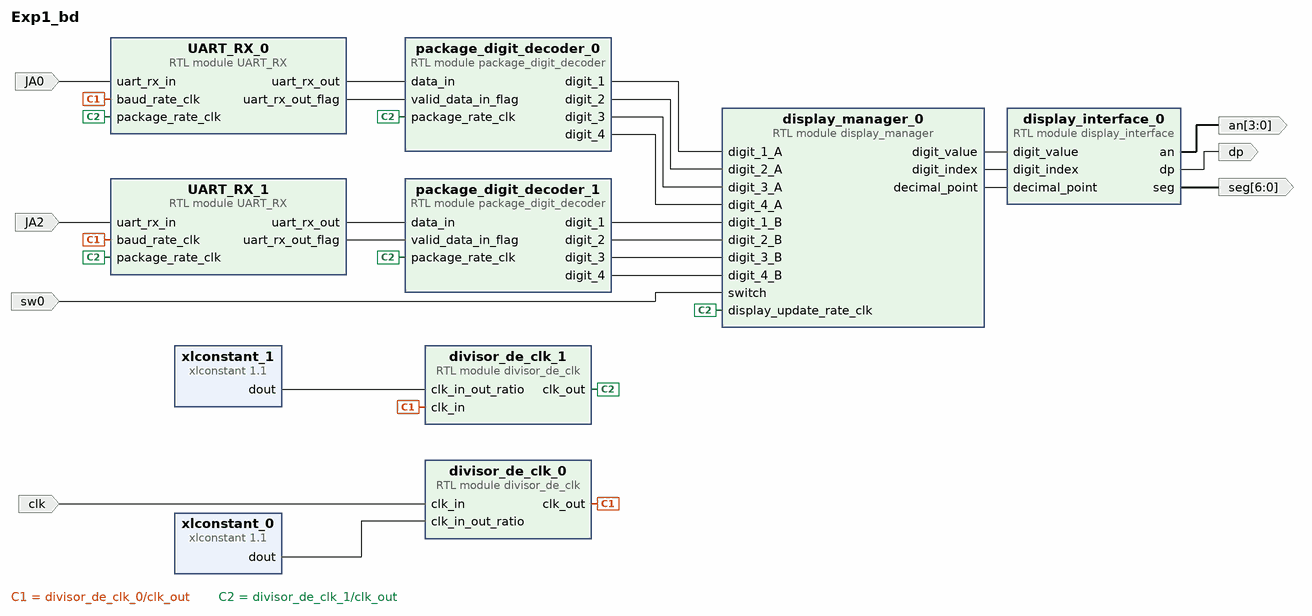
[diagram p0: block diagram of the top level]
# Vivado block design Exp1_bd, xc7a35tcpg236-1, Vivado 2020.1
create_bd_design Exp1_bd

create_bd_port -dir I clk
create_bd_port -dir I sw0
create_bd_port -dir O -from 6 -to 0 seg
create_bd_port -dir O dp
create_bd_port -dir O -from 3 -to 0 an
create_bd_port -dir I JA2
create_bd_port -dir I JA0

create_bd_cell -type module -reference divisor_de_clk divisor_de_clk_0
create_bd_cell -type ip -vlnv xilinx.com:ip:xlconstant:1.1 xlconstant_0
set_property -dict {CONFIG.CONST_VAL 10000 CONFIG.CONST_WIDTH 14} [get_bd_cells xlconstant_0]
create_bd_cell -type module -reference divisor_de_clk divisor_de_clk_1
create_bd_cell -type ip -vlnv xilinx.com:ip:xlconstant:1.1 xlconstant_1
set_property -dict {CONFIG.CONST_VAL 11 CONFIG.CONST_WIDTH 14} [get_bd_cells xlconstant_1]
create_bd_cell -type module -reference UART_RX UART_RX_0
create_bd_cell -type module -reference package_digit_decoder package_digit_decoder_0
create_bd_cell -type module -reference UART_RX UART_RX_1
create_bd_cell -type module -reference package_digit_decoder package_digit_decoder_1
create_bd_cell -type module -reference display_interface display_interface_0
create_bd_cell -type module -reference display_manager display_manager_0

# ---- connections ----

connect_bd_net -net clk_in_0_1 [get_bd_ports clk] [get_bd_pins divisor_de_clk_0/clk_in]
connect_bd_net [get_bd_pins xlconstant_0/dout] [get_bd_pins divisor_de_clk_0/clk_in_out_ratio]
connect_bd_net [get_bd_pins divisor_de_clk_0/clk_out] \
  [get_bd_pins divisor_de_clk_1/clk_in] [get_bd_pins UART_RX_0/baud_rate_clk] [get_bd_pins UART_RX_1/baud_rate_clk]
connect_bd_net [get_bd_pins xlconstant_1/dout] [get_bd_pins divisor_de_clk_1/clk_in_out_ratio]
connect_bd_net [get_bd_pins divisor_de_clk_1/clk_out] \
  [get_bd_pins UART_RX_0/package_rate_clk] [get_bd_pins package_digit_decoder_0/package_rate_clk] \
  [get_bd_pins package_digit_decoder_1/package_rate_clk] [get_bd_pins UART_RX_1/package_rate_clk] \
  [get_bd_pins display_manager_0/display_update_rate_clk]
connect_bd_net [get_bd_pins UART_RX_0/uart_rx_out] [get_bd_pins package_digit_decoder_0/data_in]
connect_bd_net [get_bd_pins UART_RX_0/uart_rx_out_flag] [get_bd_pins package_digit_decoder_0/valid_data_in_flag]
connect_bd_net [get_bd_pins UART_RX_1/uart_rx_out] [get_bd_pins package_digit_decoder_1/data_in]
connect_bd_net [get_bd_pins UART_RX_1/uart_rx_out_flag] [get_bd_pins package_digit_decoder_1/valid_data_in_flag]
connect_bd_net [get_bd_pins display_interface_0/seg] [get_bd_ports seg]
connect_bd_net [get_bd_pins display_interface_0/dp] [get_bd_ports dp]
connect_bd_net [get_bd_pins display_interface_0/an] [get_bd_ports an]
connect_bd_net -net sw0_1 [get_bd_ports sw0] [get_bd_pins display_manager_0/switch]
connect_bd_net [get_bd_pins package_digit_decoder_0/digit_1] [get_bd_pins display_manager_0/digit_1_A]
connect_bd_net [get_bd_pins package_digit_decoder_0/digit_2] [get_bd_pins display_manager_0/digit_2_A]
connect_bd_net [get_bd_pins package_digit_decoder_0/digit_3] [get_bd_pins display_manager_0/digit_3_A]
connect_bd_net [get_bd_pins package_digit_decoder_0/digit_4] [get_bd_pins display_manager_0/digit_4_A]
connect_bd_net [get_bd_pins package_digit_decoder_1/digit_1] [get_bd_pins display_manager_0/digit_1_B]
connect_bd_net [get_bd_pins package_digit_decoder_1/digit_2] [get_bd_pins display_manager_0/digit_2_B]
connect_bd_net [get_bd_pins package_digit_decoder_1/digit_3] [get_bd_pins display_manager_0/digit_3_B]
connect_bd_net [get_bd_pins package_digit_decoder_1/digit_4] [get_bd_pins display_manager_0/digit_4_B]
connect_bd_net [get_bd_pins display_manager_0/digit_value] [get_bd_pins display_interface_0/digit_value]
connect_bd_net [get_bd_pins display_manager_0/digit_index] [get_bd_pins display_interface_0/digit_index]
connect_bd_net [get_bd_pins display_manager_0/decimal_point] [get_bd_pins display_interface_0/decimal_point]
connect_bd_net -net uart_rx_in_0_1 [get_bd_ports JA2] [get_bd_pins UART_RX_1/uart_rx_in]
connect_bd_net -net uart_rx_in_1_1 [get_bd_ports JA0] [get_bd_pins UART_RX_0/uart_rx_in]

validate_bd_design
save_bd_design
